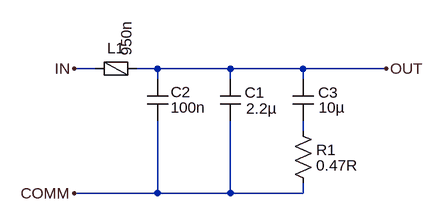
[diagram p0: schematic boost-converter_output-filter.asc]
boost-converter_output-filter.asc, the LTspice schematic file:
Version 4
SHEET 1 880 680
WIRE -32 96 -64 96
WIRE 64 96 32 96
WIRE 176 96 64 96
WIRE 288 96 176 96
WIRE 416 96 288 96
WIRE 64 112 64 96
WIRE 176 112 176 96
WIRE 288 112 288 96
WIRE 288 192 288 176
WIRE 64 288 64 176
WIRE 64 288 -64 288
WIRE 176 288 176 176
WIRE 176 288 64 288
WIRE 288 288 288 272
WIRE 288 288 176 288
FLAG -64 96 IN
FLAG 416 96 OUT
FLAG -64 288 COMM
SYMBOL cap 160 112 R0
WINDOW 0 38 21 Left 2
WINDOW 3 40 45 Left 2
SYMATTR InstName C1
SYMATTR Value 2.2µ
SYMATTR SpiceLine V=25 Irms=0 Rser=0.01 Lser=2n
SYMBOL FerriteBead 0 96 R270
WINDOW 0 16 0 VTop 2
SYMATTR InstName L1
SYMATTR Value 950n
SYMATTR SpiceLine Ipk=3 Rser=0.029 Rpar=290 Cpar=1.45p
SYMBOL cap 48 112 R0
WINDOW 0 36 20 Left 2
WINDOW 3 36 44 Left 2
SYMATTR InstName C2
SYMATTR Value 100n
SYMATTR SpiceLine V=25 Irms=0 Rser=0.001 Lser=1n
SYMBOL cap 272 112 R0
WINDOW 0 39 21 Left 2
WINDOW 3 40 44 Left 2
SYMATTR InstName C3
SYMATTR Value 10µ
SYMATTR SpiceLine V=25 Irms=0 Rser=0.001 Lser=2n
SYMBOL res 272 176 R0
WINDOW 0 36 45 Left 2
WINDOW 3 36 69 Left 2
SYMATTR InstName R1
SYMATTR Value 0.47R

The netlist it stands for:
* boost-converter_output-filter.asc
C1 OUT COMM 2.2µ V=25 Irms=0 Rser=0.01 Lser=2n
L1 IN OUT 950n Ipk=3 Rser=0.029 Rpar=290 Cpar=1.45p
C2 OUT COMM 100n V=25 Irms=0 Rser=0.001 Lser=1n
C3 OUT N001 10µ V=25 Irms=0 Rser=0.001 Lser=2n
R1 N001 COMM 0.47R
.backanno
.end